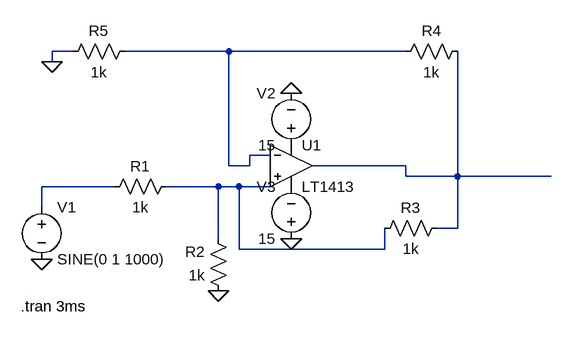
[diagram p0: schematic EXP-4_VtoI.asc]
EXP-4_VtoI.asc, the LTspice schematic file:
Version 4
SHEET 1 880 680
WIRE -128 -32 -160 -32
WIRE 112 -32 -48 -32
WIRE 384 -32 112 -32
WIRE -160 -16 -160 -32
WIRE 176 128 144 128
WIRE 112 144 112 -32
WIRE 144 144 144 128
WIRE 144 144 112 144
WIRE 384 144 240 144
WIRE 384 160 384 144
WIRE 464 160 464 -32
WIRE 464 160 384 160
WIRE 608 160 464 160
WIRE -64 176 -176 176
WIRE 96 176 16 176
WIRE 128 176 96 176
WIRE 176 176 176 160
WIRE 176 176 128 176
WIRE -176 208 -176 176
WIRE 464 240 464 160
WIRE 464 240 432 240
WIRE 96 256 96 176
WIRE 128 272 128 176
WIRE 352 272 352 240
WIRE 352 272 128 272
FLAG -160 -16 0
FLAG -176 288 0
FLAG 96 336 0
FLAG 208 32 0
FLAG 208 256 0
SYMBOL voltage -176 192 R0
WINDOW 123 0 0 Left 0
WINDOW 39 0 0 Left 0
SYMATTR InstName V1
SYMATTR Value SINE(0 1 1000)
SYMBOL res 32 160 R90
WINDOW 0 0 56 VBottom 2
WINDOW 3 32 56 VTop 2
SYMATTR InstName R1
SYMATTR Value 1k
SYMBOL res 112 352 R180
WINDOW 0 36 76 Left 2
WINDOW 3 36 40 Left 2
SYMATTR InstName R2
SYMATTR Value 1k
SYMBOL res 336 256 R270
WINDOW 0 32 56 VTop 2
WINDOW 3 0 56 VBottom 2
SYMATTR InstName R3
SYMATTR Value 1k
SYMBOL res 368 -16 R270
WINDOW 0 32 56 VTop 2
WINDOW 3 0 56 VBottom 2
SYMATTR InstName R4
SYMATTR Value 1k
SYMBOL res -144 -16 R270
WINDOW 0 32 56 VTop 2
WINDOW 3 0 56 VBottom 2
SYMATTR InstName R5
SYMATTR Value 1k
SYMBOL OpAmps\\LT1413 208 80 R0
SYMATTR InstName U1
SYMBOL voltage 208 128 R180
WINDOW 0 24 96 Left 2
WINDOW 3 24 16 Left 2
WINDOW 123 0 0 Left 0
WINDOW 39 0 0 Left 0
SYMATTR InstName V2
SYMATTR Value 15
SYMBOL voltage 208 272 R180
WINDOW 0 24 96 Left 2
WINDOW 3 24 16 Left 2
WINDOW 123 0 0 Left 0
WINDOW 39 0 0 Left 0
SYMATTR InstName V3
SYMATTR Value 15
TEXT -208 360 Left 2 !.tran 3ms

The netlist it stands for:
* EXP-4_VtoI.asc
V1 N003 0 SINE(0 1 1000)
R1 N004 N003 1k
R2 0 N004 1k
R3 N004 N002 1k
R4 N001 N002 1k
R5 0 N001 1k
XU1 N004 N001 P001 P002 N002 LT1413  ; pins In+ In- V+ V- OUT
V2 P001 0 15
V3 0 P002 15
.tran 3ms
.lib LTC.lib
.backanno
.end